# EAGLE design untitled (EAGLE 7.2.0)
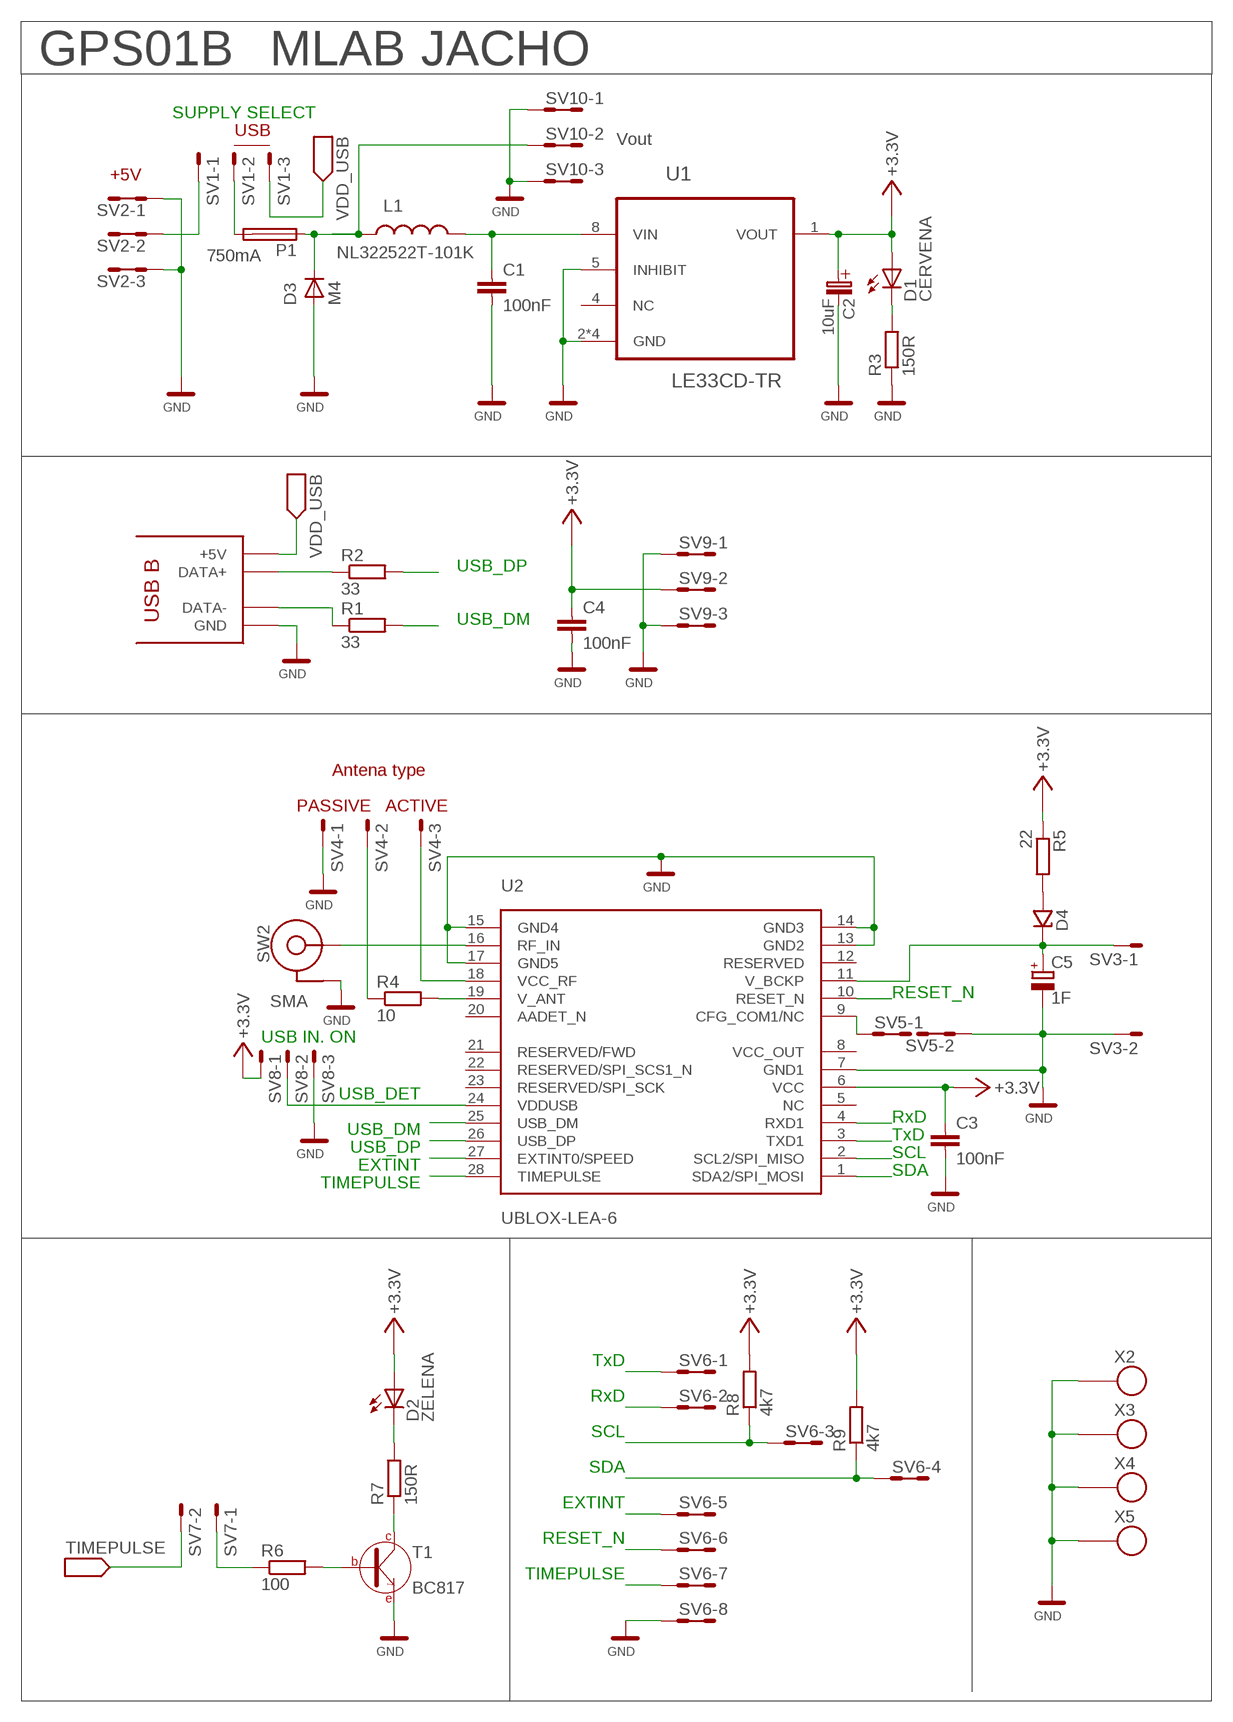
[diagram p0: schematic, sheet 1]

## Parts
C1  100nF  C0805  [C0805]
C2  10uF  B  [B]
C3  100nF  C0805  [C0805]
C4  100nF  C0805  [C0805]
C5  1F  CPOL-EUE3.5-8  [E3,5-8]
D1  CERVENA  LED1206  [1206]
D2  ZELENA  LED1206  [1206]
D3  M4  D-OB.SMA  [SMA]
D4  D-ZENEROVA  [MINIMELF]
L1  NL322522T-101K  L1210  [1210]
P1  750mA  POJISTKA_1812  [1812]
R1  33  R0805  [0805]
R2  33  R0805  [0805]
R3  150R  R0805  [0805]
R4  10  R0805  [0805]
R5  22  R0805  [0805]
R6  100  R0805  [0805]
R7  150R  R0805  [0805]
R8  4k7  R0805  [0805]
R9  4k7  R0805  [0805]
SV1  MA03-1  [MA03-1]
SV2  MA03-2  [MA03-2]
SV3  MA02-1  [MA02-1]
SV4  MA03-1  [MA03-1]
SV5  MA02-2  [MA02-2]
SV6  MA08-2  [MA08-2]
SV7  MA02-1  [MA02-1]
SV8  MA03-1  [MA03-1]
SV9  MA03-2  [MA03-2]
SV10  MA03-2  [MA03-2]
SW2  SMA  [SMA]
T1  BC817  [SOT23]
U1  LE33CD-TR  [SOIC127P600X175-8N]
U2  UBLOX-LEA-6  [UBLOX-LEA-6]
X1  USB_B  [USB_B]
X2  SROUB3M  [SROUB3M]
X3  SROUB3M  [SROUB3M]
X4  SROUB3M  [SROUB3M]
X5  SROUB3M  [SROUB3M]

## Nets
+3.3V: C2.+(C_EL+) C3.1 C4.1 D1.A D2.A R5.1 R8.2 R9.2 SV8.1 SV9.3 SV9.4 U1.1(VOUT) U2.6(VCC)
EXTINT: SV6.9 SV6.10 U2.27(EXTINT0/SPEED)
GND: C1.2 C2.-(C_EL-) C3.2 C4.2 C5.- D3.A R3.1 SV2.1 SV2.2 SV2.5 SV2.6 SV3.2 SV4.1 SV5.3 SV5.4 SV6.15 SV6.16 SV8.3 SV9.1 SV9.2 SV9.5 SV9.6 SV10.1 SV10.2 SV10.5 SV10.6 SW2.-1(-) SW2.-2(-) SW2.-3(-) SW2.-4(-) T1.2(E) U1.2(GND) U1.3(GND) U1.5(INHIBIT) U1.6(GND) U1.7(GND) U2.7(GND1) U2.13(GND2) U2.14(GND3) U2.15(GND4) U2.17(GND5) X1.4(GND) X1.GND X1.GND2(GND) X2.P$1 X3.P$1 X4.P$1 X5.P$1
N$1: SW2.+ U2.16(RF_IN)
N$2: SV1.1 SV2.3 SV2.4
N$3: R1.1 X1.2(DATA-)
N$4: R2.1 X1.3(DATA+)
N$5: C1.1 L1.P$2 U1.8(VIN)
N$6: D4.A R5.2
N$7: P1.2 SV1.2
N$8: D3.K(C) L1.P$1 P1.1 SV10.3 SV10.4
N$9: D1.K(C) R3.2
N$11: R4.2 U2.19(V_ANT)
N$13: R4.1 SV4.2
N$15: C5.+ D4.C(K) SV3.1 U2.11(V_BCKP)
N$16: SV5.1 SV5.2 U2.9(CFG_COM1/NC)
N$24: D2.K(C) R7.2
N$25: R7.1 T1.3(C)
N$26: R6.2 T1.1(B)
N$27: R6.1 SV7.1
RESET_N: SV6.11 SV6.12 U2.10(RESET_N)
RXD: SV6.3 SV6.4 U2.4(RXD1)
SCL: R8.1 SV6.5 SV6.6 U2.2(SCL2/SPI_MISO)
SDA: R9.1 SV6.7 SV6.8 U2.1(SDA2/SPI_MOSI)
TIMEPULSE: SV6.13 SV6.14 SV7.2 U2.28(TIMEPULSE)
TXD: SV6.1 SV6.2 U2.3(TXD1)
USB_DET: SV8.2 U2.24(VDDUSB)
USB_DM: R1.2 U2.25(USB_DM)
USB_DP: R2.2 U2.26(USB_DP)
VCC_RF: SV4.3 U2.18(VCC_RF)
VDD_USB: SV1.3 X1.1(+5V)
Unconnected: U1.4(NC) U2.5(NC) U2.8(VCC_OUT) U2.12(RESERVED) U2.20(AADET_N) U2.21(RESERVED/FWD) U2.22(RESERVED/SPI_SCS1_N) U2.23(RESERVED/SPI_SCK)

## Notes on the sheet
- GPS01B | MLAB | JACHO
- SUPPLY SELECT
- USB
- Vout
- +5V
- USB_DP
- USB_DM
- Antena type
- PASSIVE | ACTIVE
- RESET_N
- USB IN. ON
- USB_DET
- USB_DM | RxD
- USB_DP | TxD
- EXTINT | SCL
- TIMEPULSE | SDA
- TxD
- RxD
- SCL
- SDA
- EXTINT
- RESET_N
- TIMEPULSE

## Library data of the parts
C1 C3 C4 = moje_C:C0805
C2 = moje_C:B
C5 = rcl:CPOL-EU: POLARIZED CAPACITOR, European symbol
D1 D2 = moje_diody:LED1206: Ecom LEDS-HCL-1505
D3 = moje:D-OB.SMA: SMA
D4 = moje_diody:D-ZENEROVA
L1 = moje_L:L1210
P1 = moje:POJISTKA_1812: Pojistka s pouzdrem 1812
R1-R9 = moje_R:R0805
SV1 SV4 SV8 = moje_hrebinky:MA03-1: PIN HEADER; OC_FARNELL: unknown; OC_NEWARK: unknown
SV2 SV9 SV10 = moje_hrebinky:MA03-2: PIN HEADER; OC_FARNELL: unknown; OC_NEWARK: unknown
SV3 SV7 = moje_hrebinky:MA02-1
SV5 = moje_hrebinky:MA02-2
SV6 = moje_hrebinky:MA08-2: PIN HEADER; OC_FARNELL: unknown; OC_NEWARK: unknown
SW2 = moje_konektory:SMA
T1 = moje_T:BC817: BC817 NPN tranzistor
U1 = moje_U:LE33CD-TR: Very low drop voltage regulators with inhibit; MPN: LE33CD-TR; OC_FARNELL: 1652371; OC_NEWARK: 89K1279; PACKAGE: SOIC-8; SUPPLIER: STMICROELECTRONICS
U2 = 3DRobotics:UBLOX-LEA-6: u-blox LEA-6 GPS Module The LEA-6 module series is a family of stand-alone GPS receivers featuring the high performance u-blox 6 positioning engine. These versatile receivers feature an extensive and flexible range of functionality, connectivity and cost savings options. LEA-6 modules maintain the industry standard 17.0 x 22.4mm form factor of the LEA-5 series and have been designed to allow simple migration. Their ease of integration results in reduced costs and short time to market for a wide range of automotive, consumer and industrial applications. The 50-channel u-blox 6 positioning engine boasts a Time-To-First-Fix (TTFF) of under 1 second. The dedicated acquisition engine, with over 2 million correlators, is capable of massive parallel time/frequency space searches, enabling it to find satellites instantly. Innovative design and technology suppresses interference sources and mitigates multipath effects, giving LEA-6 GPS receivers excellent navigation performance even in the most challenging environments.; DATASHEET: http://www.u-blox.com/images/downloads/Product_Docs/LEA-6_DataSheet_%28GPS.G6-HW-09004%29.pdf; LINK: http://www.u-blox.com/en/gps-modules/pvt-modules/lea-6-family.html; MFGPN: LEA-6
X1 = moje_konektory:USB_B
X2-X5 = moje:SROUB3M

## Board
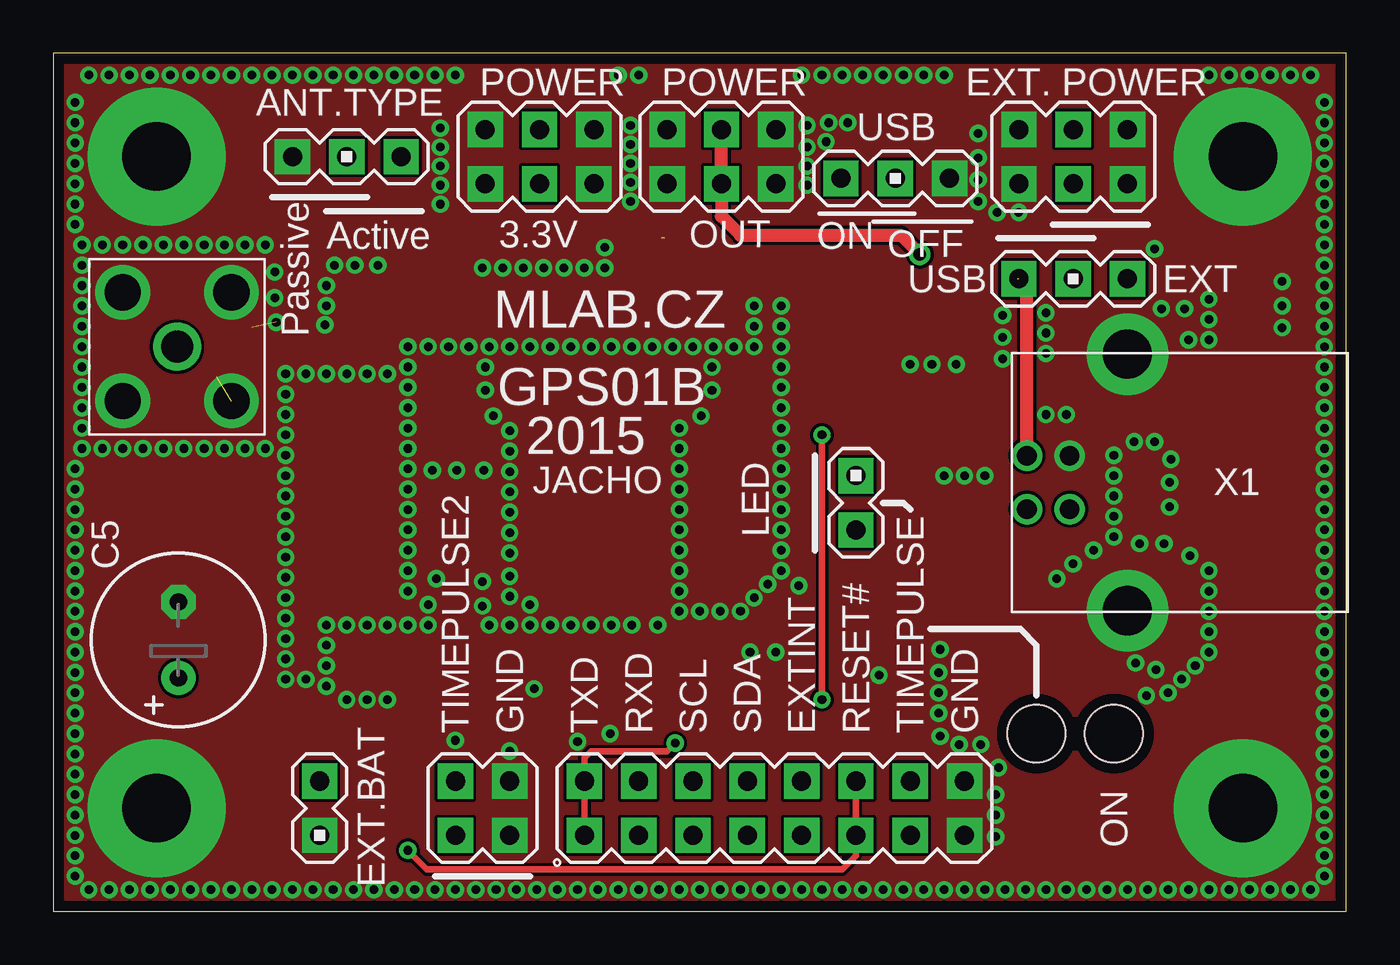
[diagram p1: board, top side]
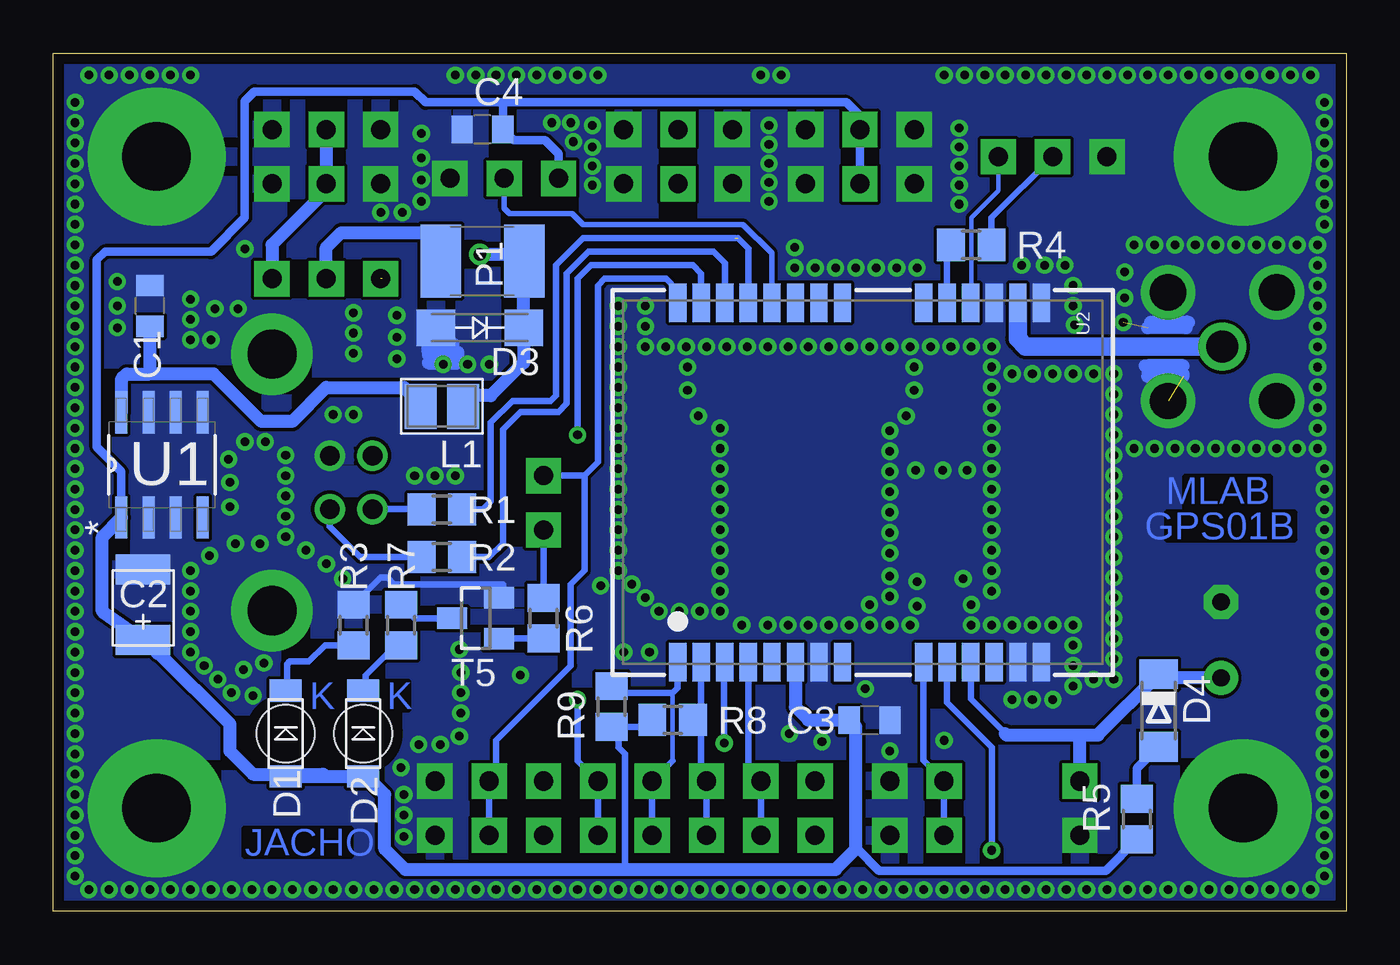
[diagram p2: board, bottom side, seen from below]

Size 60.45 x 40.13 mm. Coordinates in mm from the lower left corner, seen from the top.
Outline: 0,0 60.45,0 60.45,40.13 0,40.13 0,0
Copper layers (1*16): Top 0.035mm / dielectric 1.5mm / Bottom 0.035mm
Design rules "jacho": minimum track width 8mil, minimum drill 16mil, track to track 6mil, track to pad 6mil, pad to pad 6mil, via to via 6mil, smd to smd 6mil, copper to edge 20mil, drill to drill 8mil, minimum pad ring 10mil, minimum via ring 8mil, stop-mask expansion 4mil, vias tented up to drill 25mil, thermal gap 0mil

### Footprints (pad centres in the part's own frame; a part is rotated, then mirrored left to right if it is on the bottom)
C0805 = smd 0.991 x 1.295: 1 -0.95,0; 2 0.95,0
B = smd 1.397 x 2.54: + 1.651,0; - -1.651,0
E3,5-8 = drill 0.813 pad 1.6: + -1.778,0 | drill 0.813 pad 1.6 octagon: - 1.778,0
1206 = smd 1.5 x 1.05: A 0,-2; K 0,2 | hole 2.7: 0,0
SMA = smd 1.8 x 1.7: A -2.05,0; K 2.05,0
MINIMELF = smd 1.4 x 1.8: A 1.7,0; C -1.7,0
1210 = smd 1.5 x 2.1: P$1 -1,0; P$2 1,0
1812 = smd 1.9 x 3.4: 1 -1.95,0; 2 1.95,0
0805 = smd 1.3 x 1.5: 1 -0.95,0; 2 0.95,0
MA03-1 = drill 0.889 pad 1.651 square: 1 -2.54,0; 2 0,0; 3 2.54,0
MA03-2 = drill 0.889 pad 1.651 square: 1 -2.54,-1.27; 2 -2.54,1.27; 3 0,-1.27; 4 0,1.27; 5 2.54,-1.27; 6 2.54,1.27
MA02-1 = drill 0.889 pad 1.651 square: 1 -1.27,0; 2 1.27,0
MA02-2 = drill 0.889 pad 1.651 square: 1 -1.27,-1.27; 2 -1.27,1.27; 3 1.27,-1.27; 4 1.27,1.27
MA08-2 = drill 0.889 pad 1.651 square: 1 -8.89,-1.27; 2 -8.89,1.27; 3 -6.35,-1.27; 4 -6.35,1.27; 5 -3.81,-1.27; 6 -3.81,1.27; 7 -1.27,-1.27; 8 -1.27,1.27; 9 1.27,-1.27; 10 1.27,1.27; 11 3.81,-1.27; 12 3.81,1.27; 13 6.35,-1.27; 14 6.35,1.27; 15 8.89,-1.27; 16 8.89,1.27
SMA' = drill 1.5: + 0,0 | drill 1.7: -1 -2.54,2.54; -2 2.54,2.54; -3 -2.54,-2.54; -4 2.54,-2.54
SOT23 = smd 1 x 1.4: 1 -0.95,-1.1; 2 0.95,-1.1; 3 0,1.1
SOIC127P600X175-8N = smd 1.981 x 0.559: 1 -2.464,1.905; 2 -2.464,0.635; 3 -2.464,-0.635; 4 -2.464,-1.905; 5 2.464,-1.905; 6 2.464,-0.635; 7 2.464,0.635; 8 2.464,1.905
UBLOX-LEA-6 = smd 1.8 x 0.8: 1 8.4,-8.65; 2 8.4,-7.55; 3 8.4,-6.45; 4 8.4,-5.35; 5 8.4,-4.25; 6 8.4,-3.15; 7 8.4,-2.05; 8 8.4,-0.95; 9 8.4,2.85; 10 8.4,3.95; 11 8.4,5.05; 12 8.4,6.15; 13 8.4,7.25; 14 8.4,8.35; 15 -8.4,8.35; 16 -8.4,7.25; 17 -8.4,6.15; 18 -8.4,5.05; 19 -8.4,3.95; 20 -8.4,2.85; 21 -8.4,-0.95; 22 -8.4,-2.05; 23 -8.4,-3.15; 24 -8.4,-4.25; 25 -8.4,-5.35; 26 -8.4,-6.45; 27 -8.4,-7.55; 28 -8.4,-8.65
USB_B = drill 0.92 pad 1.422: 1 1.25,4.7; 2 -1.25,4.7; 3 -1.25,2.7; 4 1.25,2.7 | drill 2.3 pad 3.81: GND -6,0; GND2 6,0
SROUB3M = drill 3.2 pad 6.452: P$1 0,0

### Placement (x,y rotation side)
C1  55.94,28.32 90 bottom
C2  56.26,14.35 270 bottom
C3  22.29,8.95 0 bottom
C4  40.39,36.58 180 bottom
C5  5.84,12.7 90 top
D1  49.59,8.32 0 bottom
D2  45.97,8.32 0 bottom
D3  40.51,27.3 0 bottom
D4  8.76,9.4 270 bottom
L1  42.29,23.62 180 bottom
P1  40.39,30.42 180 bottom
R1  42.29,18.8 0 bottom
R2  42.29,16.57 0 bottom
R3  46.42,13.4 270 bottom
R4  17.53,31.18 180 bottom
R5  9.78,4.32 90 bottom
R6  37.53,13.72 270 bottom
R7  44.2,13.4 270 bottom
R8  31.5,8.95 180 bottom
R9  34.35,9.59 270 bottom
SV1  47.69,29.59 180 top
SV2  47.69,35.31 180 top
SV3  12.45,4.83 270 top
SV4  13.72,35.31 0 top
SV5  20.07,4.83 0 top
SV6  33.72,4.83 0 top
SV7  37.53,19.11 90 top
SV8  39.37,34.29 0 top
SV9  22.73,35.31 180 top
SV10  31.24,35.31 0 top
SW2  [SMA']  5.78,26.42 90 top
T1  40.7,13.72 90 bottom
U1  55.37,20.89 90 bottom
U2  22.61,20.07 270 bottom
X1  50.23,20.07 90 top
X2  4.83,4.83 0 top
X3  4.83,35.31 0 top
X4  55.63,4.83 0 top
X5  55.63,35.31 0 top

### Tracks (layer width: path | path; a pad name or v marks a point on that pad's centre or on a via)
+3.3V
  Bottom 0.254: 51.5,37.85 51.5,37.91
  Bottom 0.305: R8.2 32.76,8.64 R9.2 34.04,8.64 34.04,7.68 33.72,7.37 33.72,1.97
  Bottom 0.406: 51.5,37.85 51.5,32.45 53.09,30.86 58.04,30.86 58.42,30.48 58.42,21.72 57.28,20.57 U1.1 | 51.5,37.91 51.05,38.35 43.56,38.35 43.05,37.85 39.5,37.85 | 39.5,37.85 23.37,37.85 22.73,37.21 SV9.3 SV9.4 | 39.5,37.85 39.44,37.79 C4.1 38.93,36.07 37.47,36.07 36.83,35.43 SV8.1 | 22.92,2.92 22.86,2.92 21.84,1.9 11.24,1.9 R5.1
  Bottom 0.61: U2.6 25.76,9.56 25.15,8.95 C3.1 22.92,8.64 22.92,2.92 23.88,1.97 33.72,1.97 44.01,1.97 44.96,2.92 44.96,5.46 45.97,6.48 D2.A D1.A 47.84,6.41 51.12,6.41 52.2,7.49 52.2,8.76 55.5,12.07 55.56,12.07 55.63,12.13 C2.+ 58.17,14.03 58.17,17.53 U1.1
EXTINT  (via drill 0.4)
  Top 0.305: v35.94,22.29 v35.94,9.91
  Bottom 0.305: U2.27 30.16,29.84 30.54,30.23 35.31,30.23 35.94,29.59 v35.94,22.29 | v35.94,9.91 35.94,7.05 SV6.10 SV6.9
GND  (via drill 0.4)  (2 unrouted)
  Bottom 0.305: R3.1 45.15,15.62 44.83,15.62 44.51,15.3 39.43,15.3 39.43,14.84 T1.2
  Bottom 0.61: 42.93,25.65 41.53,25.65 41.53,26.16 42.93,26.16 | 42.93,26.16 42.93,26.04 | 42.93,26.16 42.93,26.54 | 42.93,26.54 41.78,26.54 41.78,26.42 | 42.93,26.54 42.93,26.92 42.55,27.3 D3.A 42.67,27.3 | 7.37,27.56 7.49,27.56 | 9.14,27.56 7.49,27.56 | 7.49,27.56 7.49,27.3 9.27,27.3 | 7.62,25.53 9.27,25.53 | 9.4,25.53 9.27,25.53 | 9.27,25.53 9.27,25.02 7.62,25.02 7.62,25.15
  other vias: 2.29,31.18 3.24,31.18 4.19,31.18 5.14,31.18 6.1,31.18 7.05,31.18 8,31.18 8.95,31.18 9.91,31.18 10.35,29.91 10.35,28.7 10.41,27.56 1.33,31.18 1.33,30.23 1.33,29.27 1.33,28.32 1.33,27.37 1.33,26.42 1.33,25.46 1.33,24.51 1.33,23.56 1.33,22.61 1.33,21.65 2.29,21.65 3.24,21.65 4.19,21.65 5.14,21.65 6.1,21.65 7.05,21.65 8,21.65 8.95,21.65 9.91,21.65 10.86,21.34 10.86,22.29 10.86,23.24 10.86,24.19 10.86,25.15 12.7,27.43 11.81,25.15 12.76,28.32 12.76,25.15 13.72,25.15 14.67,25.15 15.62,25.15 16.57,25.46 16.57,26.42 17.53,26.42 18.48,26.42 19.43,26.42 20.38,26.42 21.34,26.42 22.29,26.42 23.24,26.42 24.19,26.42 25.15,26.42 26.1,26.42 27.05,26.42 28,26.42 28.96,26.42 29.91,26.42 30.86,26.42 31.81,26.42 32.77,26.42 32.77,27.37 32.77,28.32 34.04,28.32 34.04,27.37 34.04,26.42 34.04,25.46 34.04,24.51 34.04,23.56 34.04,22.61 34.04,21.65 34.04,20.7 34.04,19.75 34.04,18.8 34.04,17.84 34.04,16.89 34.04,15.94 33.4,15.3 32.77,14.67 32.13,14.03 31.18,14.03 30.23,14.03 29.27,14.03 28.26,13.4 27.05,13.4 26.1,13.4 25.15,13.4 24.19,13.4 23.24,13.4 22.29,13.4 21.34,13.4 20.38,13.4 20.07,14.29 17.72,20.64 17.53,13.4 16.57,13.4 15.62,13.4 14.67,13.4 13.72,13.4 12.76,13.4 12.76,12.45 12.76,11.49 12.76,10.54 13.72,9.91 14.67,9.91 15.62,9.91 10.86,20.38 10.86,19.43 10.86,18.48 10.86,17.53 10.86,16.57 10.86,15.62 10.86,14.67 10.86,13.72 10.86,12.76 10.86,11.81 10.86,10.86 11.81,10.86 12.76,29.27 13.14,30.23 14.1,30.23 15.18,30.23 20.07,30.1 21.02,30.1 21.97,30.1 22.92,30.1 23.88,30.1 24.83,30.1 25.78,30.1 25.78,31.05 29.27,14.99 29.27,15.94 29.27,16.89 29.27,17.84 29.27,18.8 29.27,19.75 29.27,20.7 29.27,21.65 29.27,22.61 30.29,23.18 30.8,24.38 30.8,25.46 20.19,25.46 20.19,24.38 20.57,23.18 21.34,22.48 21.34,21.53 21.34,20.57 21.34,19.62 21.34,18.67 21.34,17.72 21.34,16.76 21.34,15.68 21.34,14.73 22.29,14.35 16.57,24.51 16.57,23.56 16.57,22.61 16.57,21.65 16.57,20.7 16.57,19.75 16.57,18.8 16.57,17.84 16.57,16.89 16.57,15.94 16.57,14.99 17.53,14.35 18.8,8 44.07,3.49 44.2,6.73 44.07,4.51 44.07,5.46 42.35,7.81 43.37,7.81 41.47,8.19 41.4,9.27 41.4,10.22 41.4,11.18 38.61,11.05 41.47,12.26 24.51,7.94 26.04,8.32 34.86,15.24 32.58,12.13 33.78,12.13 41.66,20.38 42.61,20.38 43.56,20.38 46.42,28 46.42,27.05 46.42,26.1 46.42,23.24 47.37,23.24 53.09,26.73 54.04,26.73 54.04,27.69 54.04,28.64 52.9,28.19 51.82,28.19 51.5,30.99 47.69,16.26 48.64,16.89 49.59,17.53 49.59,18.48 49.59,19.43 49.59,20.38 49.59,21.34 50.55,21.97 51.5,21.97 52.2,18.92 50.8,17.21 51.56,11.3 50.61,11.62 46.93,15.56 51.12,10.1 52.13,10.22 52.77,10.86 53.4,11.49 54.04,12.13 54.04,13.08 54.04,14.03 54.04,14.99 54.04,15.94 53.15,16.64 51.94,17.21 52.2,20.07 52.26,21.15 1.65,1.02 2.6,1.02 3.56,1.02 4.51,1.02 5.46,1.02 6.41,1.02 7.37,1.02 8.32,1.02 9.27,1.02 10.22,1.02 11.18,1.02 12.13,1.02 13.08,1.02 14.03,1.02 14.99,1.02 15.94,1.02 16.89,1.02 17.84,1.02 18.8,1.02 19.75,1.02 20.7,1.02 21.65,1.02 22.61,1.02 23.56,1.02 24.51,1.02 25.46,1.02 26.42,1.02 27.37,1.02 28.32,1.02 29.27,1.02 30.23,1.02 31.18,1.02 32.13,1.02 33.08,1.02 34.04,1.02 34.99,1.02 35.94,1.02 36.89,1.02 37.85,1.02 38.8,1.02 39.75,1.02 40.7,1.02 41.66,1.02 42.61,1.02 43.56,1.02 44.51,1.02 45.47,1.02 46.42,1.02 47.37,1.02 48.32,1.02 49.28,1.02 50.23,1.02 51.18,1.02 52.13,1.02 53.09,1.02 54.04,1.02 54.99,1.02 55.94,1.02 56.9,1.02 57.85,1.02 58.8,1.02 1.65,39.12 2.6,39.12 3.56,39.12 4.51,39.12 5.46,39.12 6.41,39.12 7.37,39.12 8.32,39.12 9.27,39.12 10.22,39.12 11.18,39.12 12.13,39.12 13.08,39.12 14.03,39.12 14.99,39.12 15.94,39.12 16.89,39.12 17.84,39.12 18.8,39.12 26.42,39.12 27.37,39.12 34.99,39.12 35.94,39.12 36.89,39.12 37.85,39.12 38.8,39.12 39.75,39.12 40.7,39.12 41.66,39.12 54.04,39.12 54.99,39.12 55.94,39.12 56.9,39.12 57.85,39.12 58.8,39.12 59.44,1.65 59.44,2.6 59.44,3.56 59.44,4.51 59.44,5.46 59.44,6.41 59.44,7.37 59.44,8.32 59.44,9.27 59.44,10.22 59.44,11.18 59.44,12.13 59.44,13.08 59.44,14.03 59.44,14.99 59.44,15.94 59.44,16.89 59.44,17.84 59.44,18.8 59.44,19.75 59.44,20.7 59.44,21.65 59.44,22.61 59.44,23.56 59.44,24.51 59.44,25.46 59.44,26.42 59.44,27.37 59.44,28.32 59.44,29.27 59.44,30.23 59.44,31.18 59.44,32.13 59.44,33.08 59.44,34.04 59.44,34.99 59.44,35.94 59.44,36.89 59.44,37.85 1.02,1.65 1.02,2.6 1.02,3.56 1.02,4.51 1.02,5.46 1.02,6.41 1.02,7.37 1.02,8.32 1.02,9.27 1.02,10.22 1.02,11.18 1.02,12.13 1.02,13.08 1.02,14.03 1.02,14.99 1.02,15.94 1.02,16.89 1.02,17.84 1.02,18.8 1.02,19.75 1.02,20.7 1.02,32.13 1.02,33.08 1.02,34.04 1.02,34.99 1.02,35.94 1.02,36.89 1.02,37.85 37.15,36.89 57.47,29.46 57.47,28.32 57.47,27.3 36.26,36.89 36.13,36 35.24,36.77 18.1,36.64 18.1,35.75 18.1,34.86 18.1,33.97 18.1,33.08 44.39,27.88 44.39,26.86 44.39,25.84 45.15,32.7 44.13,32.7 43.24,33.21 43.24,34.23 43.24,35.24 43.24,36.39 35.24,33.97 35.24,34.86 35.24,35.75 26.99,36.77 26.99,35.88 26.99,34.99 26.99,34.1 26.99,33.21 40.07,25.59 41.08,25.59 42.23,25.59 21.34,7.49 22.48,10.41 20.07,15.43 18.86,20.64 20.13,20.64 17.91,15.56
  pour Bottom: 59.94,39.62 0.44,39.62 0.44,0.51 59.94,0.51
  pour Top: 60.26,40.01 0.19,39.88 0.19,0.19 60.26,0.19
N$1
  Bottom 0.861: U2.16 15.36,26.79 14.99,26.42 SW2.+
N$2
  Bottom 0.61: SV2.3 SV2.4 47.69,33.72 50.23,31.18 SV1.1
N$3
  Bottom 0.305: X1.2 43.26,18.82 R1.1
N$4
  Bottom 0.305: X1.3 47.53,18 46.1,16.57 R2.1
N$5
  Bottom 0.61: C1.1 55.94,25.15 | 55.94,25.15 52.96,25.15 50.74,22.92 49.28,22.92 47.69,24.51 44.07,24.51 43.29,23.73 L1.P$2 | U1.8 57.28,24.89 57.02,25.15 55.94,25.15
N$6
  Bottom 0.406: R5.2 9.78,6.68 D4.A
N$7
  Bottom 0.61: SV1.2 47.69,31.05 46.99,31.75 42.55,31.75 42.04,31.24 42.04,30.72 P1.2
N$8  (via drill 0.6)
  Top 0.61: SV10.4 SV10.3 31.24,32.51 32.13,31.62 39.62,31.62 v40.51,30.73
  Bottom 0.61: L1.P$1 41.29,23.89 41.4,24 41.28,24.13 40.01,24.13 38.46,25.67 D3.K 38.46,30.39 P1.1 38.75,30.73 v40.51,30.73
N$9
  Bottom 0.305: R3.2 47.75,12.45 48.51,11.68 49.4,11.68 49.53,11.56 49.53,10.13 D1.K
N$11
  Bottom 0.305: U2.19 18.66,31 R4.2
N$13
  Bottom 0.305: R4.1 16.58,32.45 SV4.2
N$15
  Bottom 0.305: U2.11 17.56,9.94 15.94,8.32
  Bottom 0.61: 12.45,8.26 15.88,8.26 15.94,8.32 | SV3.1 12.45,8.26 | 12.45,8.26 11.61,8.26 D4.C 8.59,10.92 C5.+
N$16
  Bottom 0.305: U2.9 19.76,7.06 SV5.2 SV5.1
N$24
  Bottom 0.305: 45.85,10.41 45.85,11.05 44.45,12.45 R7.2
  Bottom 0.406: 45.85,10.41 45.97,10.29 D2.K
N$25
  Bottom 0.305: T1.3 43.56,13.72 R7.1
N$26
  Bottom 0.305: T1.1 R6.2
N$27
  Bottom 0.305: R6.1 SV7.1
RESET_N  (via drill 0.4)
  Top 0.305: v16.57,2.86 17.46,1.97 36.89,1.97 37.53,2.6 SV6.11 SV6.12
  Bottom 0.305: v16.57,2.86 16.57,7.68 18.66,9.77 U2.10
RXD
  Bottom 0.305: U2.4 27.96,6.68 SV6.4 SV6.3
SCL
  Bottom 0.305: U2.2 30.16,8.95 | 30.16,8.95 30.16,6.34 SV6.6 SV6.5 | R8.1 30.16,8.95
SDA
  Bottom 0.203: 31.5,10.22 31.5,7.05
  Bottom 0.305: 31.5,7.05 SV6.8 SV6.7 | 31.18,11.49 31.18,11.59 U2.1 31.26,10.46 31.5,10.22 34.35,10.22 R9.1
TIMEPULSE
  Bottom 0.305: U2.28 31.26,29.03 31.81,29.59 34.67,29.59 34.99,29.27 34.99,21.02 35.62,20.38 | 35.62,20.38 35.62,15.94 36.26,15.3 36.26,11.49 39.75,8 39.75,6.41 SV6.14 SV6.13 | SV7.2 35.62,20.38
TXD  (via drill 0.4)
  Top 0.305: SV6.1 SV6.2 24.83,7.18 25.15,7.49 28.7,7.49 v29.08,7.87
  Bottom 0.305: v29.08,7.87 29.08,11.64 U2.3
USB_DET
  Bottom 0.254: U2.24 26.86,30.79 28.19,32.13 35.69,32.13 36.2,32.64 39.12,32.64 39.37,32.89 SV8.2
USB_DM  (1 unrouted)
  Bottom 0.305: U2.25 27.96,31 28.45,31.5 | R1.2 40.39,18.8 40.01,19.18 40.01,22.86 38.99,23.88 37.21,23.88 36.96,24.13 36.96,30.23 35.69,31.5 28.57,31.5
USB_DP
  Bottom 0.305: U2.26 29.06,30.33 29.59,30.86 35.43,30.86 36.45,29.84 36.45,23.75 36.83,23.37 38.61,23.37 39.43,22.54 39.43,17.21 40.07,16.57 R2.2
VCC_RF
  Bottom 0.204: SV4.3 16.26,33.72 17.53,32.45 17.53,28.5 U2.18
VDD_USB  (1 unrouted)
  Top 0.61: X1.1 45.53,29.15 45.09,29.59

### Text on the board
Bottom: MLAB | GPS01B | JACHO
tPlace: POWER | POWER | USB | EXT. POWER | ANT.TYPE | Passive | Active | 3.3V | OUT | ON | OFF | USB | EXT | MLAB.CZ | GPS01B | 2015 | JACHO | LED | TIMEPULSE2 | GND | TXD | RXD | SCL | SDA | EXTINT | RESET# | TIMEPULSE | GND | ON | EXT.BAT
bNames: T5